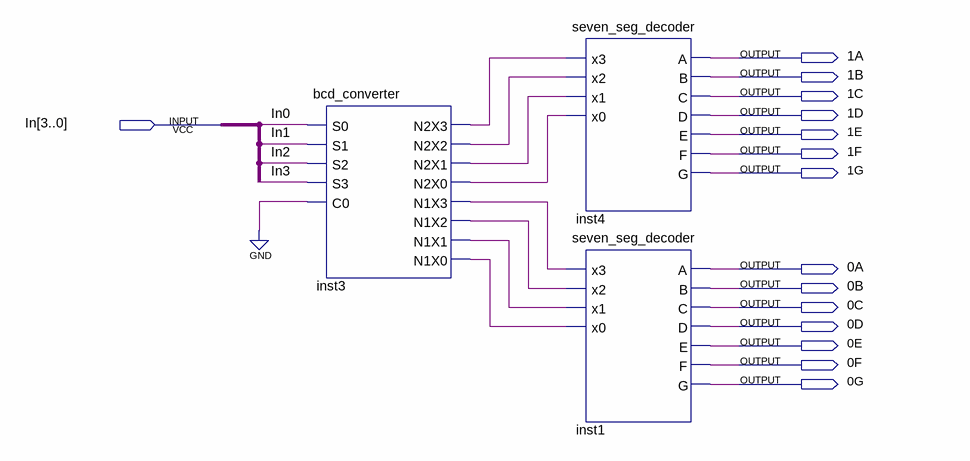
[diagram p0: schematic sheet]
// Quartus schematic bcdANDssd.bdf as structural Verilog: 3 symbols, 15 pins
module bcdANDssd (
  input  [3:0] In,
  output \1A ,
  output \1B ,
  output \1C ,
  output \1D ,
  output \1E ,
  output \1F ,
  output \1G ,
  output \0A ,
  output \0B ,
  output \0C ,
  output \0D ,
  output \0E ,
  output \0F ,
  output \0G 
);

  wire inst3_n1x0, inst3_n1x1, inst3_n1x2, inst3_n1x3, inst3_n2x0, inst3_n2x1, inst3_n2x2, inst3_n2x3;

  bcd_converter inst3 (
    .S0(In[0]), .S1(In[1]), .S2(In[2]), .S3(In[3]), .C0(1'b0), .N2X3(inst3_n2x3), .N2X2(inst3_n2x2),
    .N2X1(inst3_n2x1), .N2X0(inst3_n2x0), .N1X3(inst3_n1x3), .N1X2(inst3_n1x2), .N1X1(inst3_n1x1),
    .N1X0(inst3_n1x0));
  seven_seg_decoder inst4 (
    .x3(inst3_n2x3), .x2(inst3_n2x2), .x1(inst3_n2x1), .x0(inst3_n2x0), .A(\1A ), .B(\1B ), .C(\1C ),
    .D(\1D ), .E(\1E ), .F(\1F ), .G(\1G ));
  seven_seg_decoder inst1 (
    .x3(inst3_n1x3), .x2(inst3_n1x2), .x1(inst3_n1x1), .x0(inst3_n1x0), .A(\0A ), .B(\0B ), .C(\0C ),
    .D(\0D ), .E(\0E ), .F(\0F ), .G(\0G ));
endmodule
